# Altium schematic sheet io.SchDoc
size A4; SheetNumber: 3; SheetTotal: 8
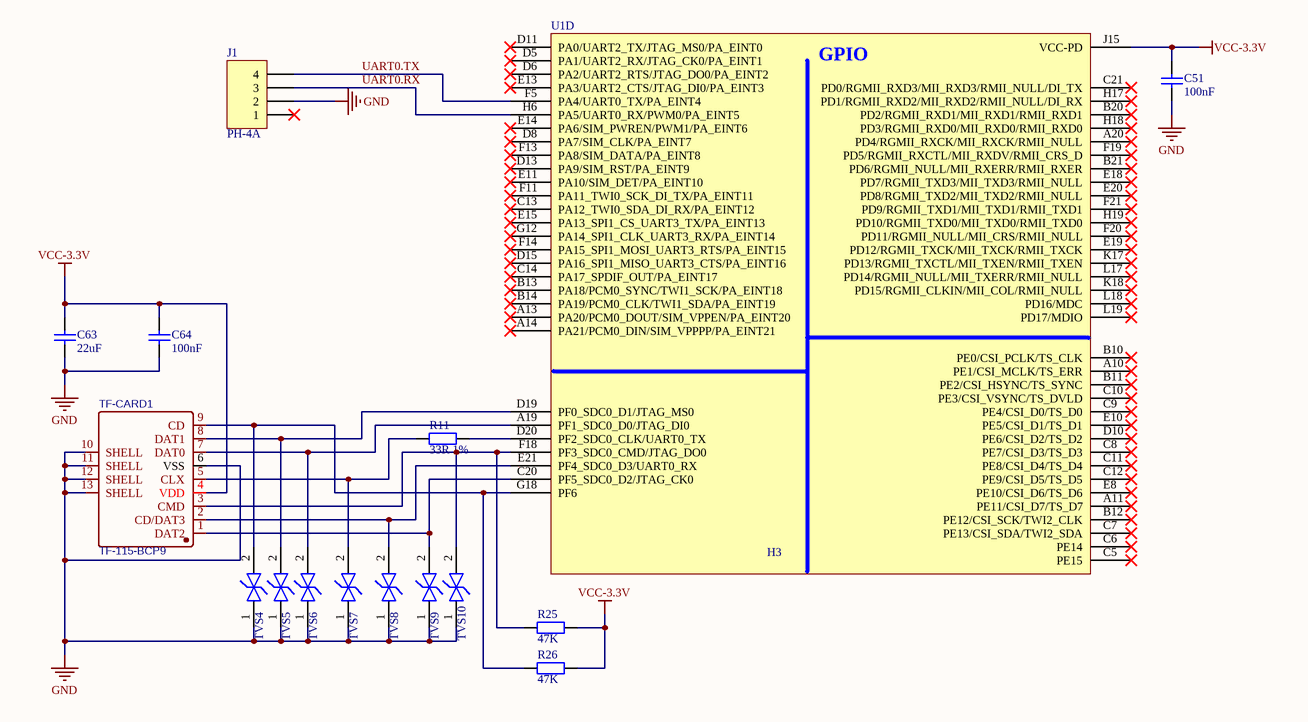
[diagram p0: io.SchDoc]

## Parts
C51  100nF  [0402_C]
C63  22uF  [0603_C]
C64  100nF  [0402_C]
J1  PH-4A  [CONN-TH_PH-4A]
R11  33R 1%  [0402_R]
R25  47K  [0402_R]
R26  47K  [0402_R]
TF-CARD1  TF-115-BCP9  [TF-115-BCP9]
TVS4  BSD5C051L  [SOD-523_TVS]  (value not drawn)
TVS5  BSD5C051L  [SOD-523_TVS]  (value not drawn)
TVS6  BSD5C051L  [SOD-523_TVS]  (value not drawn)
TVS7  BSD5C051L  [SOD-523_TVS]  (value not drawn)
TVS8  BSD5C051L  [SOD-523_TVS]  (value not drawn)
TVS9  BSD5C051L  [SOD-523_TVS]  (value not drawn)
TVS10  BSD5C051L  [SOD-523_TVS]  (value not drawn)
U1  H3  [allwinner-h3]  (part D of 9)

## Nets
GND: C51.2 C63.2 C64.2 J1.2 TF-CARD1.6(VSS) TF-CARD1.10(SHELL) TF-CARD1.11(SHELL) TF-CARD1.12(SHELL) TF-CARD1.13(SHELL) TVS4.1 TVS5.1 TVS6.1 TVS7.1 TVS8.1 TVS9.1 TVS10.1
VCC-3.3V: C51.1 C63.1 C64.1 R25.2 R26.2 TF-CARD1.4(VDD) U1.J15(VCC-PD)
UART0.RX: J1.3 U1.H6(PA5/UART0_RX/PWM0/PA_EINT5)
UART0.TX: J1.4 U1.F5(PA4/UART0_TX/PA_EINT4)
NetR11_1: R11.1 TF-CARD1.5(CLX) TVS7.2
NetR11_2: R11.2 U1.D20(PF2_SDC0_CLK/UART0_TX)
NetR25_1: R25.1 TF-CARD1.3(CMD) TVS10.2 U1.F18(PF3_SDC0_CMD/JTAG_DO0)
NetR26_1: R26.1 TF-CARD1.9(CD) TVS4.2 U1.G18(PF6)
NetTF-CARD1_1: TF-CARD1.1(DAT2) TVS9.2 U1.C20(PF5_SDC0_D2/JTAG_CK0)
NetTF-CARD1_2: TF-CARD1.2(CD/DAT3) TVS8.2 U1.E21(PF4_SDC0_D3/UART0_RX)
NetTF-CARD1_7: TF-CARD1.7(DAT0) TVS6.2 U1.A19(PF1_SDC0_D0/JTAG_DI0)
NetTF-CARD1_8: TF-CARD1.8(DAT1) TVS5.2 U1.D19(PF0_SDC0_D1/JTAG_MS0)

Not connected (* = marked no-connect by the designer): J1 1*; U1 A10(PE1/CSI_MCLK/TS_ERR)* A11(PE11/CSI_D7/TS_D7)* A13(PA20/PCM0_DOUT/SIM_VPPEN/PA_EINT20)* A14(PA21/PCM0_DIN/SIM_VPPPP/PA_EINT21)* A20(PD4/RGMII_RXCK/MII_RXCK/RMII_NULL)* B10(PE0/CSI_PCLK/TS_CLK)* B11(PE2/CSI_HSYNC/TS_SYNC)* B12(PE12/CSI_SCK/TWI2_CLK)* B13(PA18/PCM0_SYNC/TWI1_SCK/PA_EINT18)* B14(PA19/PCM0_CLK/TWI1_SDA/PA_EINT19)* B20(PD2/RGMII_RXD1/MII_RXD1/RMII_RXD1)* B21(PD6/RGMII_NULL/MII_RXERR/RMII_RXER)* C5(PE15)* C6(PE14)* C7(PE13/CSI_SDA/TWI2_SDA)* C8(PE7/CSI_D3/TS_D3)* C9(PE4/CSI_D0/TS_D0)* C10(PE3/CSI_VSYNC/TS_DVLD)* C11(PE8/CSI_D4/TS_D4)* C12(PE9/CSI_D5/TS_D5)* C13(PA12_TWI0_SDA_DI_RX/PA_EINT12)* C14(PA17_SPDIF_OUT/PA_EINT17)* C21(PD0/RGMII_RXD3/MII_RXD3/RMII_NULL/DI_TX)* D5(PA1/UART2_RX/JTAG_CK0/PA_EINT1)* D6(PA2/UART2_RTS/JTAG_DO0/PA_EINT2)* D8(PA7/SIM_CLK/PA_EINT7)* D10(PE6/CSI_D2/TS_D2)* D11(PA0/UART2_TX/JTAG_MS0/PA_EINT0)* D13(PA9/SIM_RST/PA_EINT9)* D15(PA16_SPI1_MISO_UART3_CTS/PA_EINT16)* E8(PE10/CSI_D6/TS_D6)* E10(PE5/CSI_D1/TS_D1)* E11(PA10/SIM_DET/PA_EINT10)* E13(PA3/UART2_CTS/JTAG_DI0/PA_EINT3)* E14(PA6/SIM_PWREN/PWM1/PA_EINT6)* E15(PA13_SPI1_CS_UART3_TX/PA_EINT13)* E18(PD7/RGMII_TXD3/MII_TXD3/RMII_NULL)* E19(PD12/RGMII_TXCK/MII_TXCK/RMII_TXCK)* E20(PD8/RGMII_TXD2/MII_TXD2/RMII_NULL)* F11(PA11_TWI0_SCK_DI_TX/PA_EINT11)* F13(PA8/SIM_DATA/PA_EINT8)* F14(PA15_SPI1_MOSI_UART3_RTS/PA_EINT15)* F19(PD5/RGMII_RXCTL/MII_RXDV/RMII_CRS_D)* F20(PD11/RGMII_NULL/MII_CRS/RMII_NULL)* F21(PD9/RGMII_TXD1/MII_TXD1/RMII_TXD1)* G12(PA14_SPI1_CLK_UART3_RX/PA_EINT14)* H17(PD1/RGMII_RXD2/MII_RXD2/RMII_NULL/DI_RX)* H18(PD3/RGMII_RXD0/MII_RXD0/RMII_RXD0)* H19(PD10/RGMII_TXD0/MII_TXD0/RMII_TXD0)* K17(PD13/RGMII_TXCTL/MII_TXEN/RMII_TXEN)* K18(PD15/RGMII_CLKIN/MII_COL/RMII_NULL)* L17(PD14/RGMII_NULL/MII_TXERR/RMII_NULL)* L18(PD16/MDC)* L19(PD17/MDIO)*

## Notes on the sheet
- (in symbol H3_CPU, part D) GPIO

## Library data of the parts
C51 C63 C64 = CAP-SMD: smd capacitor
J1 = Header-4pin: Header, 4-Pin
R11 R25 R26 = RES-SMD: smd resistor
TF-CARD1 = TF-CARD: TF card
TVS4-TVS10 = TVS-DIODE-SMD: Transient Voltage Suppressor
U1 = H3_CPU: CPU